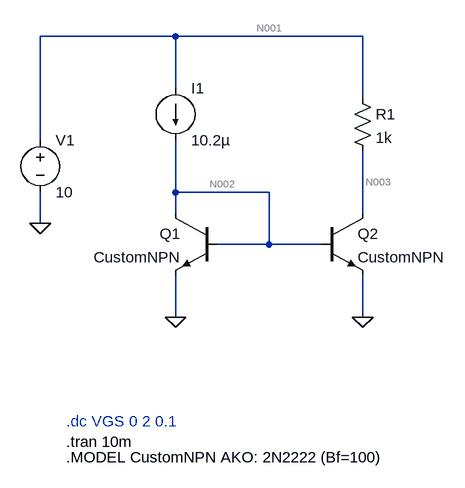
[diagram p0: schematic CurrentMirrorNPN.asc]
CurrentMirrorNPN.asc, the LTspice schematic file:
Version 4
SHEET 1 880 680
WIRE 224 -160 16 -160
WIRE 512 -160 224 -160
WIRE 224 -80 224 -160
WIRE 512 -64 512 -160
WIRE 16 0 16 -160
WIRE 224 80 224 0
WIRE 368 80 224 80
WIRE 224 112 224 80
WIRE 512 112 512 16
WIRE 16 128 16 80
WIRE 368 160 368 80
WIRE 368 160 288 160
WIRE 448 160 368 160
WIRE 224 272 224 208
WIRE 512 272 512 208
FLAG 16 128 0
FLAG 224 272 0
FLAG 512 272 0
SYMBOL npn 288 112 M0
SYMATTR InstName Q1
SYMATTR Value CustomNPN
SYMBOL npn 448 112 R0
SYMATTR InstName Q2
SYMATTR Value CustomNPN
SYMBOL voltage 16 -16 R0
WINDOW 123 0 0 Left 0
WINDOW 39 0 0 Left 0
SYMATTR InstName V1
SYMATTR Value 10
SYMBOL current 224 -80 R0
WINDOW 123 0 0 Left 0
WINDOW 39 0 0 Left 0
SYMATTR InstName I1
SYMATTR Value 10.2µ
SYMBOL res 496 -80 R0
SYMATTR InstName R1
SYMATTR Value 1k
TEXT 56 432 Left 2 ;.dc VGS 0 2 0.1
TEXT 56 464 Left 2 !.tran 10m
TEXT 56 488 Left 2 !.MODEL CustomNPN AKO: 2N2222 (Bf=100)

The netlist it stands for:
* CurrentMirrorNPN.asc
Q1 N002 N002 0 0 CustomNPN
Q2 N003 N002 0 0 CustomNPN
V1 N001 0 10
I1 N001 N002 10.2µ
R1 N001 N003 1k
.model NPN NPN
.model PNP PNP
.lib standard.bjt
* .dc VGS 0 2 0.1
.tran 10m
.MODEL CustomNPN AKO: 2N2222 (Bf=100)
.backanno
.end

* Results of the author's LTspice run, read from the files saved beside the schematic
* Operating Point, zero values left out:
*   V(n002) = 536 mV
*   V(n003) = 9.989 V
*   V(n001) = 10 V
*   Ic(Q1) = 10 µA
*   Ib(Q1) = 100 nA
*   Ie(Q1) = -10.1 µA
*   Ic(Q2) = 10.95 µA
*   Ib(Q2) = 99.99 nA
*   Ie(Q2) = -11.05 µA
*   I(I1) = 10.2 µA
*   I(R1) = 10.95 µA
*   I(V1) = -21.15 µA